# Altium schematic sheet USB.SchDoc
size Letter; SheetNumber: 3; SheetTotal: 5
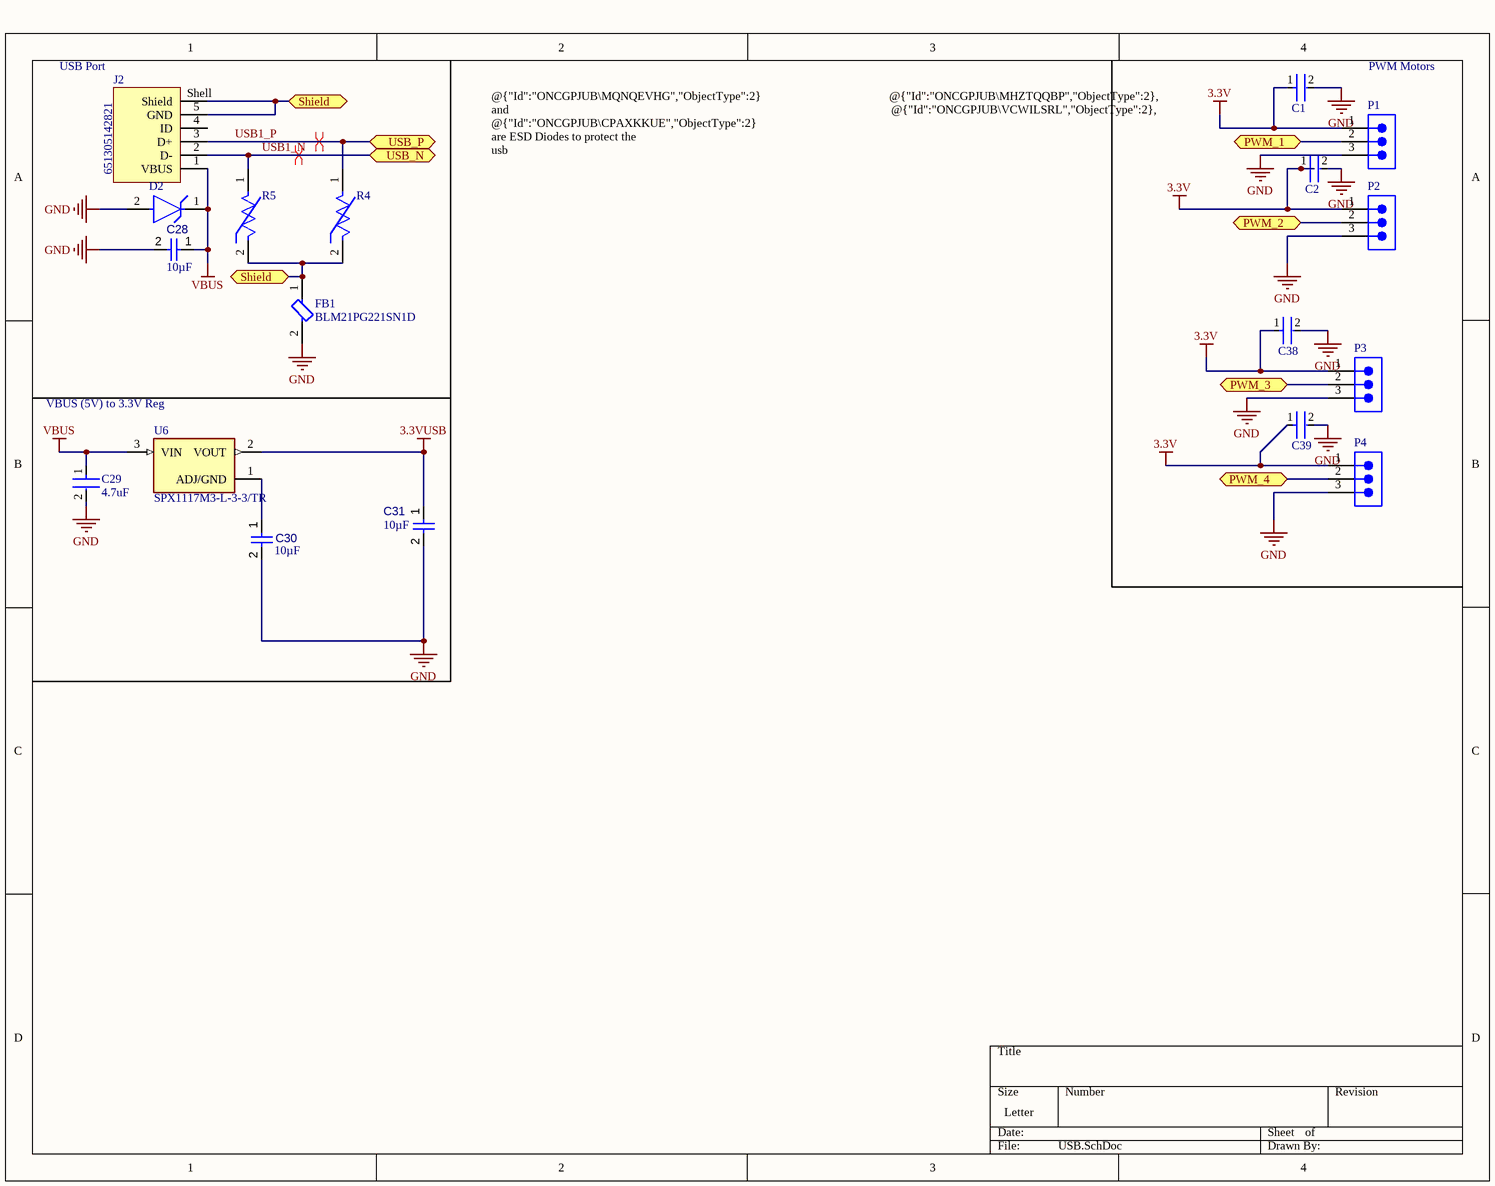
[diagram p0: USB.SchDoc]

## Parts
C1  GRM033Z71C104KE14J  [FP-GRM033-0_03-IPC_A]  (value not drawn)
C2  GRM033Z71C104KE14J  [FP-GRM033-0_03-IPC_A]  (value not drawn)
C28  value 10µF  [CAPC0603(1608)100_L]  (hidden comment: Capacitor 10µF +/-20% 10V 0603)
C29  4.7uF  [FP-RDE3P1-MFG]
C30  value 10µF  [CAPC0603(1608)100_L]  (hidden comment: 10uF)
C31  value 10µF  [CAPC0603(1608)100_L]  (hidden comment: 10uF)
C38  GRM033Z71C104KE14J  [FP-GRM033-0_03-IPC_A]  (value not drawn)
C39  GRM033Z71C104KE14J  [FP-GRM033-0_03-IPC_A]  (value not drawn)
D2  TVS305E3  [FP-BODY-A-MFG]  (value not drawn)
FB1  BLM21PG221SN1D  [FP-BLM21-0_2-t0_85-e0_5-IPC_B]
J2  651305142821  [651305142821]
P1  61300311121  [61300311121]  (value not drawn)
P2  61300311121  [61300311121]  (value not drawn)
P3  61300311121  [61300311121]  (value not drawn)
P4  61300311121  [61300311121]  (value not drawn)
R4  CG0603MLC-05LE  [FP-CG0603-MFG]  (value not drawn)
R5  CG0603MLC-05LE  [FP-CG0603-MFG]  (value not drawn)
U6  SPX1117M3-L-3-3/TR  [SOT230P700X180-3N]

## Ports
PWM_1 (bidir), PWM_2 (bidir), PWM_3 (bidir), PWM_4 (bidir), Shield (bidir), USB_N (bidir), USB_P (bidir)

## Nets
3.3V: C1.1 C2.1 C38.1 C39.1 P1.1 P2.1 P3.1 P4.1
3.3VUSB: C31.1 U6.2(VOUT)
GND: C1.2 C2.2 C28.2 C29.2 C30.2 C31.2 C38.2 C39.2 D2.2(A) FB1.2 P1.3 P2.3 P3.3 P4.3
VBUS: C28.1 C29.1 D2.1(C) J2.1(VBUS) U6.3(VIN)
PWM_1: P1.2 ; port PWM_1
PWM_2: P2.2 ; port PWM_2
PWM_3: P3.2 ; port PWM_3
PWM_4: P4.2 ; port PWM_4
Shield: FB1.1 J2.5(GND) J2.Shell(Shield) R4.2 R5.2 ; port Shield
USB1_N: J2.2(D-) R5.1 ; port USB_N
USB1_P: J2.3(D+) R4.1 ; port USB_P
NetC30_1: C30.1 U6.1(ADJ/GND)

Not connected (* = marked no-connect by the designer): J2 4(ID)

## Layout directives
differential pair: USB1_N, USB1_P

## Notes on the sheet
- USB Port
- @{"Id":"ONCGPJUB\MHZTQQBP","ObjectType":2}, @{"Id":"ONCGPJUB\VCWILSRL","ObjectType":2}, @{"Id":"ONCGPJUB\JLPVZJUW","ObjectType":2}, and @{"Id":"ONCGPJUB\LRMUBTTG","ObjectType":2} are used for PWM Motors
- PWM Motors
- @{"Id":"ONCGPJUB\MQNQEVHG","ObjectType":2} and @{"Id":"ONCGPJUB\CPAXKKUE","ObjectType":2} are ESD Diodes to protect the usb
- (near U6) VBUS (5V) to 3.3V Reg

## Library data of the parts
C1 C2 C38 C39 = CMP-06035-043202-1: Chip Multilayer Ceramic Capacitors for General Purpose, 0201, 0.10uF, X7R, 15%, 10%, 16V
C28 C30 C31 = CMP-001-00075-4: Chip Capacitor, 10µF +/-20%, 10V, 0603, Thickness 1 mm; Tolerance: 10%; Voltage Rating: 10V; Max Operating Temperature: 85°C; Pins: 2; Case/Package: 0603; Mounting Technology: SMT; Min Operating Temperature: -55°C
C29 = CMP-00260-148573962-1: RDEC72A475K3P1H03B; Voltage Rating: 100V; Material: Ceramic; Capacitance: 4.7µF; Tolerance: 10%; Case/Package: Radial; Height: 7.5mm; Lifecycle Status: Production; Min Operating Temperature: -55°C; Max Operating Temperature: 125°C
D2 = CMP-00252-101806678-1: TVS305E3 Uni-Directional Tvs A-Body Rohs Compliant: Yes; Direction: Unidirectional; Number of Channels: 1; Clamping Voltage: 8.7V; Breakdown Voltage: 6V; Reverse Standoff Voltage: 5V; Peak Pulse Current: 17A; Peak Pulse Power: 150W; NexarPartId: 101806678; Case/Package: Axial; Max Operating Temperature: 175°C; Min Operating Temperature: -65°C; Height: 2.16mm
FB1 = CMP-0686-00610-3: Chip Ferrite Bead, 0805, 220Ω @ 100MHz, 0.045Ω, 25%, 2A; Number of Circuits: 1; Shielding: Unshielded; DC Resistance (DCR): 45mR; Impedance: 220R; Radiation Hardening: No; Material: Ferrite; Frequency: 100MHz; Width: 1.25mm; DC Current: 2A; Max DC Current: 2A; Number of Lines: 1; Package Quantity: 1; Case Code (Metric): 2012; Current Rating: 2A; Case/Package: 0805; Current: 2A; Military Standard: Not; Core Material: Ferrite; Depth: 1.25mm; Contact Plating: Tin; DC Resistance-Max: 45mR; Max Operating Temperature: 125°C; Length: 2mm; Max Current Rating: 2A; REACH SVHC: No SVHC; Termination: SMD/SMT; Min Operating Temperature: -55°C; Series: BLM21P; Test Frequency: 100MHz; Tolerance: 25%; Number of Pins: 2; RoHS Compliant: Yes; Height: 0.85mm; Packaging: Tape and Reel; Lead Free: Lead Free; Case Code (Imperial): 0805
J2 = CMP-1502-03247-2: NexarPartId: 19991175; Operating Supply Voltage: 30V; Current Rating: 1A; Contact Resistance: 20mΩ; Connector Type: USB; Number of Contacts: 5; USB Standard: USB 2.0; Gender: Receptacle; Insulation Resistance: 1GΩ; REACH SVHC: Unknown; Contact Plating: Gold; Min Operating Temperature: -40°C; Features: Shielded; RoHS: Compliant; Contact Material: Copper; Packaging: Tape and Reel; Termination: SMD/SMT; Max Operating Temperature: 105°C; Orientation: Horizontal; Number of Pins: 5; Mount: Horizontal, Surface Mount; Lead Free: Lead Free
P1-P4 = CMP-1502-01062-3: NexarPartId: 32855521; Current Rating: 3A; Voltage Rating: 250V; Number of Positions: 3; Pitch: 2.54mm; Contact Resistance: 20mΩ; Connector Type: Male Pin; Gender: Male; REACH SVHC: Unknown; Packaging: Bulk; Contact Material: Copper; Min Operating Temperature: -40°C; Number of Rows: 1; Orientation: Vertical; RoHS: Compliant; Contact Plating: Gold; Max Operating Temperature: 105°C; Mount: Through Hole; Height: 8.94mm; Operating Supply Voltage: 250V; Number of Pins: 3; Contact Mating Length: 5.9944mm; Number of Contacts: 3; Color: Black; Lead Free: Lead Free; Lead Pitch: 2.54mm; Termination: Solder
R4 R5 = CMP-07402-000005-1: VARISTOR 0603; Manufacturer: Bourns Inc.; Clamping Voltage: 25V; Varistor Voltage: 5V; Esd Protec Present: true; Value: 0.5pF; Digikey Description: VARISTOR 0603; Device Class L3: unset; Lead Free: Yes; RoHS: TRUE; Category: Res; Manufacturer Part Number: CG0603MLC-05LE; Height: 0.55mm; Temperature Range Low: -40°C; Mouser Description: ESD Suppressors Chip Guard 0603 5 Volts; Temperature Range High: +85°C; ComponentLink2URL: https://www.bourns.com/docs/Product-Datasheets/MLC.pdf; Automotive: No; Octopart: https://octopart.com/cg0603mlc-05le-bourns-7576245; Temperature: -40°C to +85°C; Ipc Land Pattern Name: RESC16080X45; ComponentLink2Description: Datasheet; Device Class L2: Varistors; Capacitance: 0.5pF; Package: CG0603; Voltage Rating Dc: 5V; Device Class L1: Circuit Protection
U6 = CMP-031-00007-1: Linear Voltage Regulator IC Positive Fixed 1 Output 800mA SOT-223-3; MF: MaxLinear; Design Item ID: SPX1117M3-L-3-3/TR; Check_prices: https://www.snapeda.com/parts/SPX1117M3-L-3-3/TR/MaxLinear/view-part/?ref=eda; MP: SPX1117M3-L-3-3/TR; SnapEDA_Link: https://www.snapeda.com/parts/SPX1117M3-L-3-3/TR/MaxLinear/view-part/?ref=snap; Pins: 3; Case/Package: SOT-223 MaxLinear; Component Type: Standard; Value: *; Source: SPX1117M3-L-3-3_TR.SchLib